# EAGLE schematic DataCollectorV1 v17 (EAGLE 9.7.0)
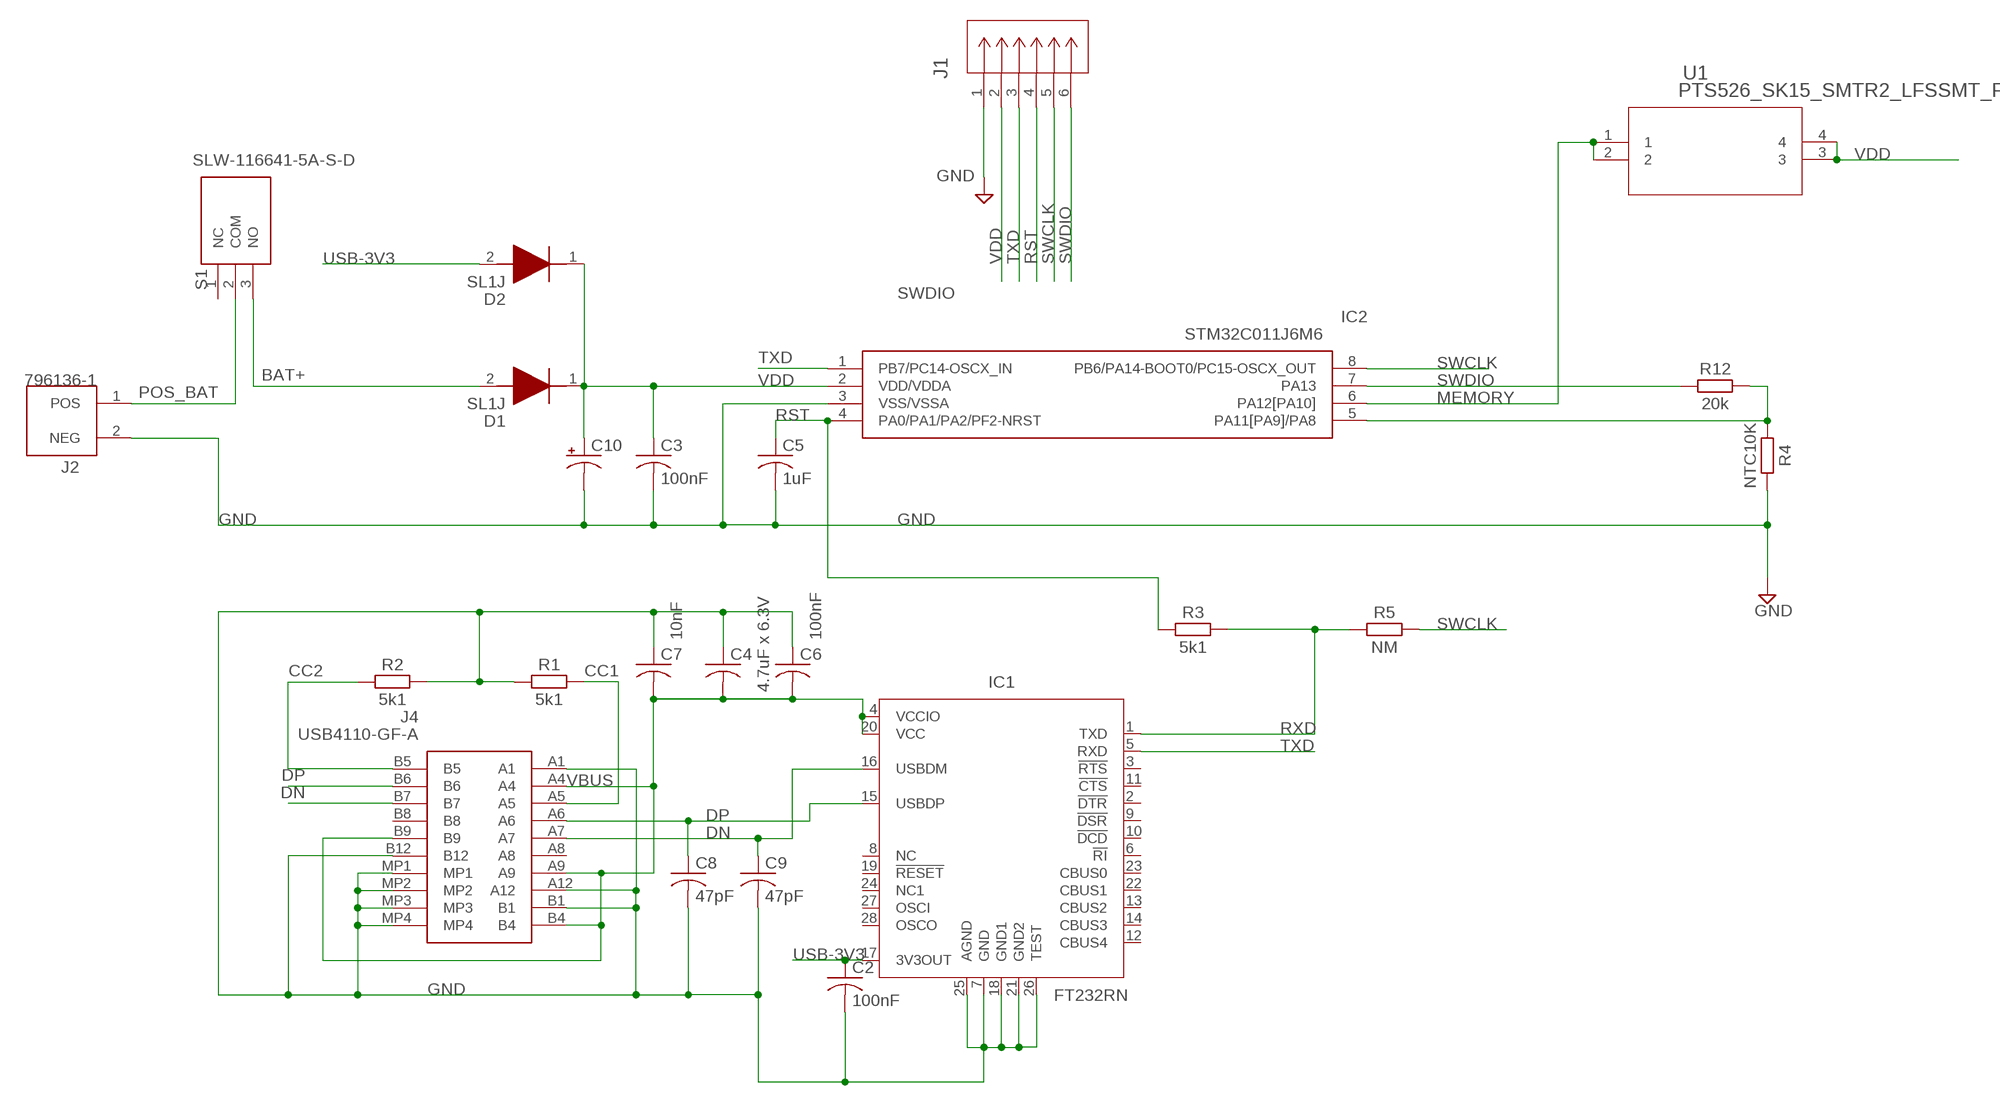
[diagram p0: schematic, sheet 1]

## Parts
C2  100nF  C-US_CHIP-0805(2012-METRIC)  [CAPC2012X110]
C3  100nF  C-US_CHIP-0805(2012-METRIC)  [CAPC2012X110]
C4  4.7uF x 6.3V  C-US_CHIP-1206(3216-METRIC)  [CAPC3216X135]
C5  1uF  C-US_CHIP-0805(2012-METRIC)  [CAPC2012X110]
C6  100nF  C-US_CHIP-0805(2012-METRIC)  [CAPC2012X110]
C7  10nF  C-US_CHIP-0805(2012-METRIC)  [CAPC2012X110]
C8  47pF  C-US_CHIP-0805(2012-METRIC)  [CAPC2012X110]
C9  47pF  C-US_CHIP-0805(2012-METRIC)  [CAPC2012X110]
C10  C-POL-US_ECAP-8.5MM  [CAPAE830X1050N]
D1  SL1J  [SODFL3718X130N]
D2  SL1J  [SODFL3718X130N]
IC1  FT232RN  FT232RL_SSOP  [SSOP28]
IC2  STM32C011J6M6  [SOIC127P600X175-8N]
J1  530470610CON_530470610_MOL  [CON_530470610_MOL]
J2  796136-1  [796136-1]
J4  USB4110-GF-A  [USB4110GFA]
R1  5k1  R_CHIP-0805(2012-METRIC)  [RESC2012X65]
R2  5k1  R_CHIP-0805(2012-METRIC)  [RESC2012X65]
R3  5k1  R_CHIP-0805(2012-METRIC)  [RESC2012X65]
R4  NTC10K  R_CHIP-0805(2012-METRIC)  [RESC2012X65]
R5  NM  R_CHIP-0805(2012-METRIC)  [RESC2012X65]
R12  20k  R_CHIP-0805(2012-METRIC)  [RESC2012X65]
S1  SLW-116641-5A-S-D  [SLW1166415ASD]
U1  PTS526_SK15_SMTR2_LFSSMT_FS  [SMT_FS]

## Nets
BAT+: D1.2(A) S1.3(NO)
CC1: J4.A5 R1.2
CC2: J4.B5 R2.1
DN: C9.1 IC1.16(USBDM) J4.A7 J4.B7
DP: C8.1 IC1.15(USBDP) J4.A6 J4.B6
GND: C2.2 C3.2 C4.1 C5.2 C6.1 C7.1 C8.2 C9.2 C10.2(-) IC1.7(GND) IC1.18(GND1) IC1.21(GND2) IC1.25(AGND) IC1.26(TEST) IC2.3(VSS/VSSA) J1.1 J2.2(NEG) J4.A1 J4.A12 J4.B1 J4.B12 J4.MP1 J4.MP2 J4.MP3 J4.MP4 R1.1 R2.2 R4.2
MEMORY: IC2.6(PA12[PA10]) U1.1 U1.2
NTC: IC2.5(PA11[PA9]/PA8) R4.1 R12.2
POS_BAT: J2.1(POS) S1.2(COM)
RST: C5.1 IC2.4(PA0/PA1/PA2/PF2-NRST) J1.4 R3.1
RXD: IC1.1(TXD) R3.2 R5.1
SWCLK: IC2.8(PB6/PA14-BOOT0/PC15-OSCX_OUT) J1.5 R5.2
SWDIO: IC2.7(PA13) J1.6 R12.1
TXD: IC1.5(RXD) IC2.1(PB7/PC14-OSCX_IN) J1.3
USB-3V3: C2.1 D2.2(A) IC1.17(3V3OUT)
VBUS: C4.2 C6.2 C7.2 IC1.4(VCCIO) IC1.20(VCC) J4.A4 J4.A9 J4.B4 J4.B9
VDD: C3.1 C10.1(+) D1.1(K) D2.1(K) IC2.2(VDD/VDDA) J1.2 U1.3 U1.4
Unconnected: IC1.2(!DTR) IC1.3(!RTS) IC1.6(!RI) IC1.8(NC) IC1.9(!DSR) IC1.10(!DCD) IC1.11(!CTS) IC1.12(CBUS4) IC1.13(CBUS2) IC1.14(CBUS3) IC1.19(!RESET) IC1.22(CBUS1) IC1.23(CBUS0) IC1.24(NC1) IC1.27(OSCI) IC1.28(OSCO) J4.A8 J4.B8 S1.1(NC)

## Library data of the parts
C2-C9 = Capacitor:C-US: Capacitor - ANSI; CATEGORY: Capacitor
C10 = Capacitor:C-POL-US: Capacitor Polarised - ANSI; CATEGORY: Capacitor
D1 D2 = SL1J:SL1J: Rectifier Diode Switching 600V 1A 1000ns 2-Pin SOD-123FL T/R Source: Datasheet <https://diotec.com/request/datasheet/sl1a.pdf>; DESCRIPTION: Rectifier Diode Switching 600V 1A 1000ns 2-Pin SOD-123FL T/R; HEIGHT: 1.3mm; MANUFACTURER_NAME: Diotec; MANUFACTURER_PART_NUMBER: SL1J; MOUSER_PART_NUMBER: 637-SL1J; MOUSER_PRICE-STOCK: https://www.mouser.co.uk/ProductDetail/Diotec-Semiconductor/SL1J?qs=OlC7AqGiEDm%2FUyNJqMVviA%3D%3D
IC1 = IC_Interface:FT232RL: USB Bridge, USB to UART USB 2.0 UART Interface Datasheet <https://www.ftdichip.com/Support/Documents/DataSheets/ICs/DS_FT232R.pdf>; CATEGORY: IC_Interface; MANUFACTURER: FTDI Chip; MPN: FT232RL; OPERATING_TEMP: -40 to 85°C; PART_STATUS: Active; ROHS_COMPLIANT: Compliant; SUB-CATEGORY: Controller; THERMALLOSS: 0.5W; TYPE: USB to UART; VALUE: FT232RL
IC2 = STM32C011J6M6:STM32C011J6M6: Mainstream Arm Cortex-M0+ MCU with 32 Kbytes of Flash memory, 6 Kbytes RAM, 48 MHz CPU, 2x USART, timers, ADC, comm. I/F, 2-3.6V Source: Datasheet <https://www.st.com/resource/en/datasheet/stm32c011d6.pdf>; DESCRIPTION: Mainstream Arm Cortex-M0+ MCU with 32 Kbytes of Flash memory, 6 Kbytes RAM, 48 MHz CPU, 2x USART, timers, ADC, comm. I/F, 2-3.6V; HEIGHT: 1.75mm; MANUFACTURER_NAME: STMicroelectronics; MANUFACTURER_PART_NUMBER: STM32C011J6M6; MOUSER_PART_NUMBER: 511-STM32C011J6M6; MOUSER_PRICE-STOCK: https://www.mouser.co.uk/ProductDetail/STMicroelectronics/STM32C011J6M6?qs=IPgv5n7u5Qas2LaNYHG%2FbQ%3D%3D
J1 = Library:530470610; COPYRIGHT: Copyright (C) 2024 Ultra Librarian. All rights reserved.; MANUFACTURER_PART_NUMBER: 530470610; MFR_NAME: Molex Connector Corporation
J2 = Connectors:796136-1: BATTERY HOLDER COIN 20MM SMD Manufacturer's datasheet <https://www.te.com/commerce/DocumentDelivery/DDEController?Action=srchrtrv&DocNm=796136&DocType=Customer+Drawing&DocLang=English>; CREATED_BY: PCBLayout.com; DIGIKEY_PART_NUMBER: A99327CT-ND; MANUFACTURER: TE Connectivity AMP Connectors; MPN: 796136-1
J4 = USB4110-GF-A:USB4110-GF-A: CONN USB 2.0 TYPE-C R/A SMT Source: Datasheet <https://gct.co/files/drawings/usb4110.pdf>; DESCRIPTION: CONN USB 2.0 TYPE-C R/A SMT; HEIGHT: 3.26mm; MANUFACTURER_NAME: GCT (GLOBAL CONNECTOR TECHNOLOGY); MANUFACTURER_PART_NUMBER: USB4110-GF-A; MOUSER_PART_NUMBER: 640-USB4110-GF-A; MOUSER_PRICE-STOCK: https://www.mouser.co.uk/ProductDetail/GCT/USB4110-GF-A?qs=KUoIvG%2F9IlYiZvIXQjyJeA%3D%3D
R1-R5 R12 = Resistor:R: Resistor Fixed - Generic; CATEGORY: Resistor; SUB-CATEGORY: Fixed
S1 = SLW-116641-5A-S-D:SLW-116641-5A-S-D: 11.6 x 6 x 4.1 mm, 5 mm Raised Slide Actuator, Through Hole, Slide Switch Source: Datasheet <https://www.sameskydevices.com/product/resource/supplyframepdf/slw-116641-5a-s-d.pdf>; ARROW_PART_NUMBER: SLW-116641-5A-S-D; ARROW_PRICE-STOCK: https://www.arrow.com/en/products/slw-116641-5a-s-d/cui-devices?utm_currency=USD&region=nac; DESCRIPTION: 11.6 x 6 x 4.1 mm, 5 mm Raised Slide Actuator, Through Hole, Slide Switch; HEIGHT: 11.3mm; MANUFACTURER_NAME: Same Sky; MANUFACTURER_PART_NUMBER: SLW-116641-5A-S-D; MOUSER_PART_NUMBER: 179-SLW1166415ASD; MOUSER_PRICE-STOCK: https://www.mouser.co.uk/ProductDetail/Same-Sky/SLW-116641-5A-S-D?qs=IKkN%2F947nfBZSdW8n5Vqgw%3D%3D
U1 = 2023-10-17_07-06-43_Library:PTS526_SK15_SMTR2_LFS; COPYRIGHT: Copyright (C) 2023 Ultra Librarian. All rights reserved.; MANUFACTURER_PART_NUMBER: PTS526 SK15 SMTR2 LFS; MFR_NAME: C&K Components